# Altium project ELC0205 - Power Entry Module.PrjPCB
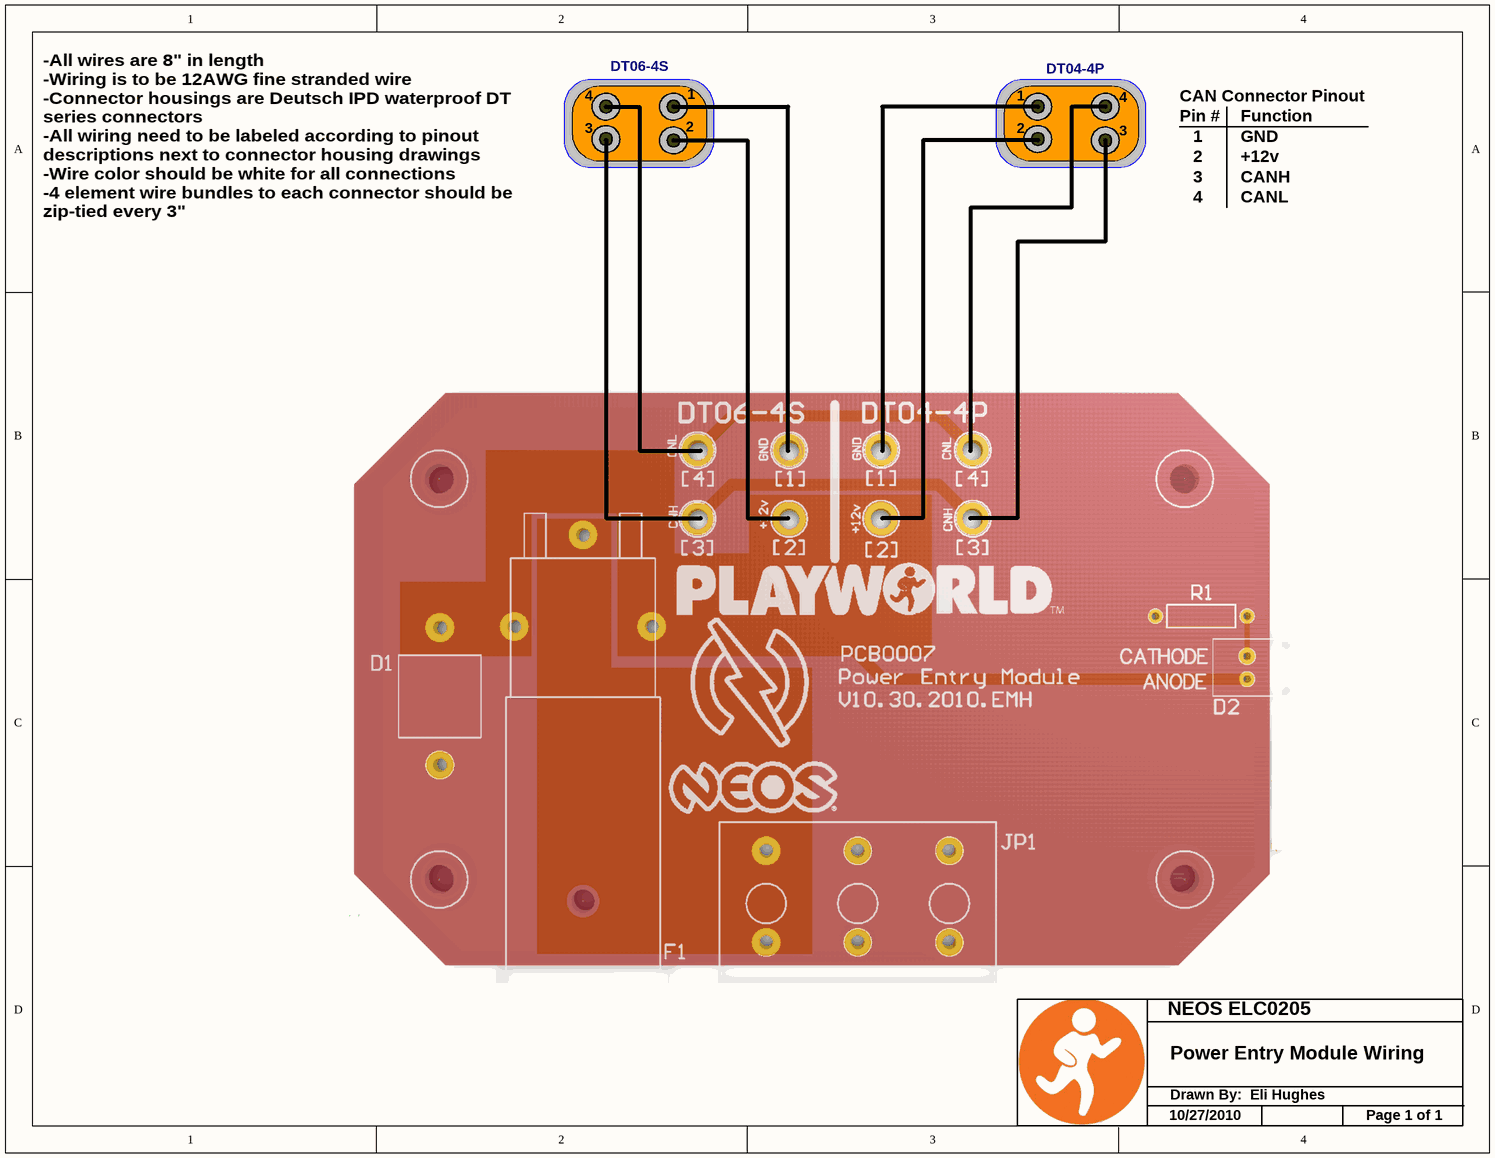
[diagram p0: ELC0205-Wiring.SchDoc]
2 sheets, 19 parts. Net scope: global (net labels, ports and power ports of the same name join across sheets).
Board file: PCB0007.PcbDoc
Sheets:
  ELC0205-Wiring.SchDoc
  ELC0205.SchDoc

## Sheet ELC0205-Wiring.SchDoc
size Letter; PageSetup: Record=PageOptions|CenterHorizontal=True|CenterVertical=True|PrintScale=1.07|XCorrection=1.00|YCorrection=1.00|PrintKind=2|BorderSize=5000000|LeftOffset=0|BottomOffset=0|Orientation=2|PaperLength=1000|PaperWidth=1000|Scale=100|PaperSource=15|PrintQuality=1200|MediaType=1|DitherType=10|PaperKind=Letter|PrintScaleMode=1

### Notes on the sheet
- 4
- DT06-4S
- 1
- DT04-4P
- CAN Connector Pinout
- 3
- 2
- Pin #
- Function
- GND
- +12v
- CANH
- CANL
- -All wires are 8" in length
  -Wiring is to be 12AWG fine stranded wire
  -Connector housings are Deutsch IPD waterproof DT series connectors
  -All wiring need to be labeled according to pinout descriptions next to connector housing drawings
  -Wire color should be white for all connections
  -4 element wire bundles to each connector should be zip-tied every 3"
- NEOS ELC0205
- Power Entry Module Wiring
- Drawn By:  Eli Hughes
- 10/27/2010
- Page 1 of 1

## Sheet ELC0205.SchDoc
size Letter; PageSetup: Record=PageOptions|CenterHorizontal=True|CenterVertical=True|PrintScale=1.07|XCorrection=1.00|YCorrection=1.00|PrintKind=2|BorderSize=5000000|LeftOffset=0|BottomOffset=0|Orientation=2|PaperLength=1000|PaperWidth=1000|Scale=100|PaperSource=15|PrintQuality=1200|MediaType=1|DitherType=10|PaperKind=Letter|PrintScaleMode=1
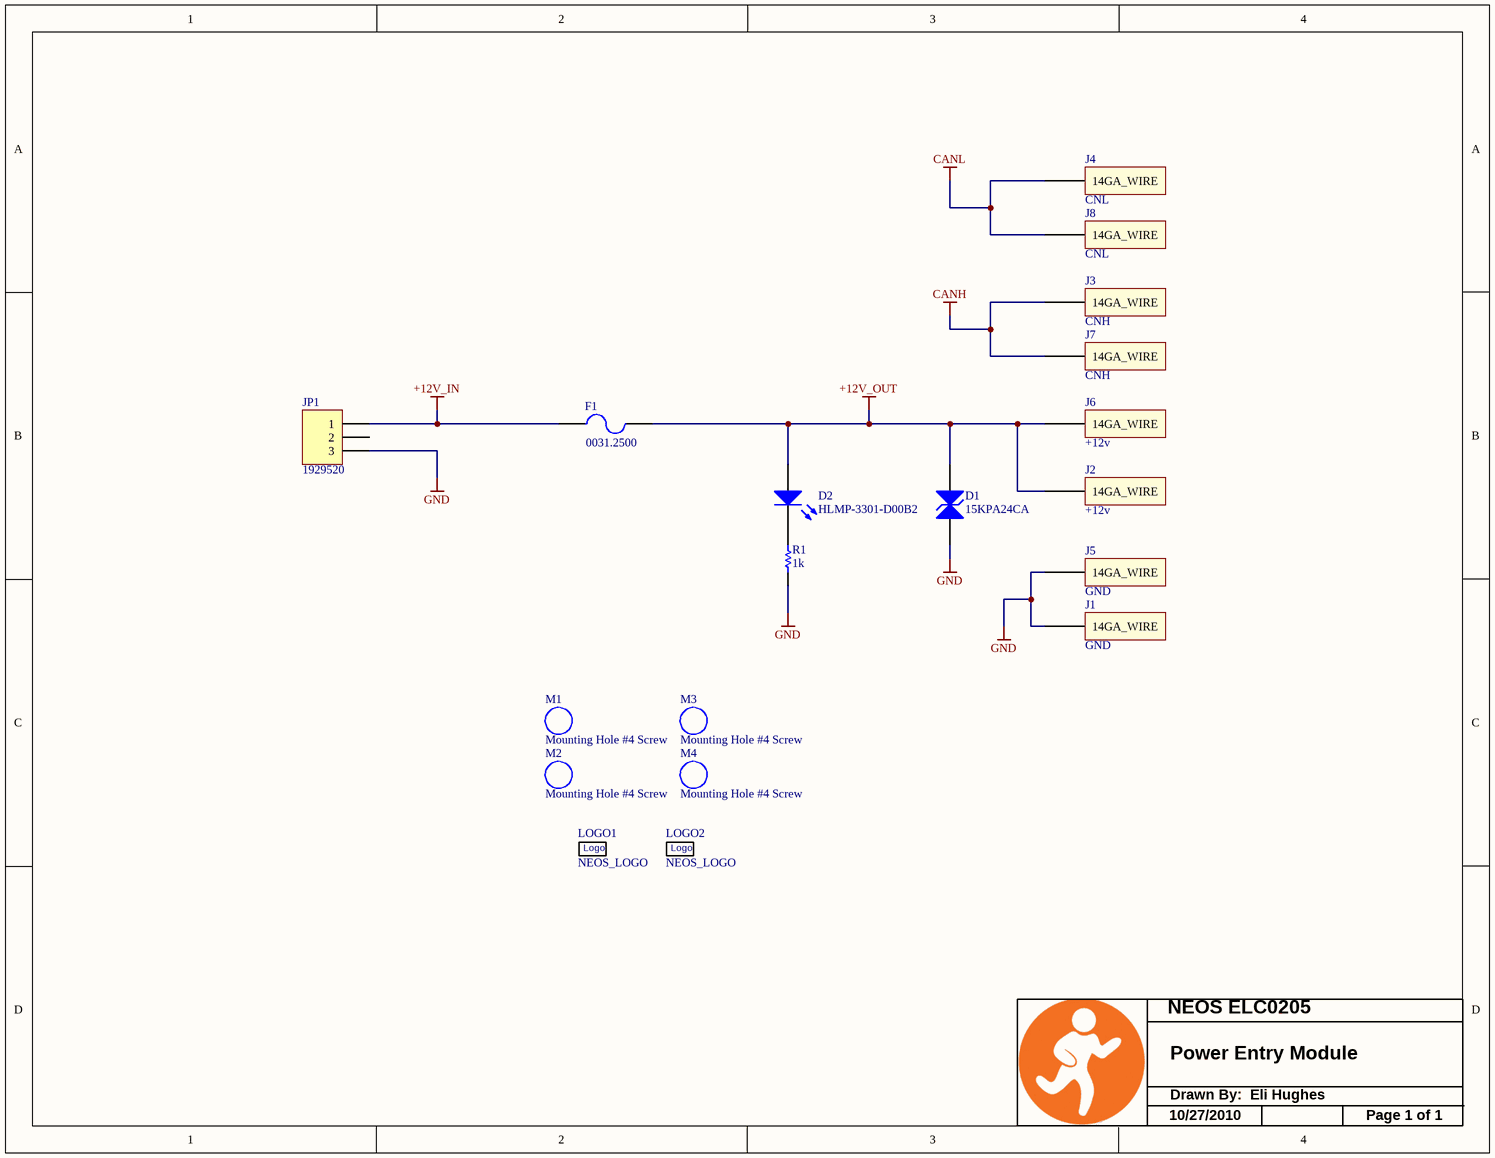
[diagram p1: ELC0205.SchDoc]

### Parts
D1  15KPA24CA  [15KP]
D2  HLMP-3301-D00B2  [LED-2]
F1  Manufacturer Part Number: 0031.2500  [Schurter 0031.2500]  (hidden comment: 30A Fuse Holder)
J1  GND  [WIRE_14GA]  (no BOM)
J2  +12v  [WIRE_14GA]  (no BOM)
J3  CNH  [WIRE_14GA]  (no BOM)
J4  CNL  [WIRE_14GA]  (no BOM)
J5  GND  [WIRE_14GA]  (no BOM)
J6  +12v  [WIRE_14GA]  (no BOM)
J7  CNH  [WIRE_14GA]  (no BOM)
J8  CNL  [WIRE_14GA]  (no BOM)
JP1  1929520  [MKDS10]
LOGO1  NEOS_LOGO  [NEOS_LOGO_0]  (no BOM)
LOGO2  NEOS_LOGO  [FULL_LOGO_1]  (no BOM)
M1  Mounting Hole #4 Screw  [MHole#4]  (no BOM)
M2  Mounting Hole #4 Screw  [MHole#4]  (no BOM)
M3  Mounting Hole #4 Screw  [MHole#4]  (no BOM)
M4  Mounting Hole #4 Screw  [MHole#4]  (no BOM)
R1  1k  [R01M025 Axial 0.4]

### Nets
+12V_IN: F1.1 JP1.1
+12V_OUT: D1.2(K) D2.1(A) F1.2 J2.1(14GA_WIRE) J6.1(14GA_WIRE)
CANH: J3.1(14GA_WIRE) J7.1(14GA_WIRE)
CANL: J4.1(14GA_WIRE) J8.1(14GA_WIRE)
GND: D1.1(A) J1.1(14GA_WIRE) J5.1(14GA_WIRE) JP1.3 R1.1
NetD2_2: D2.2(K) R1.2

Not connected (* = marked no-connect by the designer): JP1 2

### Notes on the sheet
- NEOS ELC0205
- Power Entry Module
- Drawn By:  Eli Hughes
- 10/27/2010
- Page 1 of 1
- (in symbol NEOS_LOGO) Logo

### Library data of the parts
D1 = 15KP: 15000W Axial Leaded Transient Voltage Suppressor; Manufacturer: Littelfuse Inc; Manufacturer Part Number: 15KPA24CA-B; Supplier 1: Arrow; Supplier Part Number 1: 15KPA24CA-B; Value: 15KPA24CA
D2 = LRDLN21RPHLP: LED 5MM GAP RED RT ANGLE HOUSING; Manufacturer: Avago Technologies US Inc.; Manufacturer Part Number: HLMP-3301-D00B2; Supplier 1: Digikey; Supplier Part Number 1: 516-1761-ND; Value: HLMP-3301-D00B2
F1 = Fuse 2: Shock-Safe Fuseholder, 5 x 20 / 6.3 x 32 mm, Slot Knob, horizontal; Manufacturer: Schurter; Supplier 1: Avnet; Supplier Part Number 1: 0031.2500; Value: 30A Fuse Holder
J1-J8 = ~14GA_WIRE
JP1 = Header 3: Fixed Terminal Blocks MKDSP 10 HV/ 3-10.; Manufacturer: Phoenix Contact; Manufacturer Part Number: 1929520; Value: 1929520; Supplier 1: Mouser; Supplier Part Number 1: 651-1929520
M1-M4 = MountingHole_4
R1 = R01M025: RES 1.0K OHM CARBON FILM 1/4W 5%; Manufacturer: Panasonic - ECG; Manufacturer Part Number: ERD-S2TJ102V; Supplier 1: Digikey; Supplier Part Number 1: P1.0KBACT-ND; Value: 1k
LOGO1 LOGO2 = NEOS_LOGO
  LOGO2: Manufacturer: *; Manufacturer Part Number: *; Source: *; Source Part Number: *; Value: *; ROHS Certificate: *